# EAGLE design output (EAGLE 7.2.0)
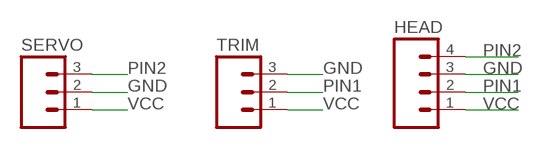
[diagram p0: schematic, sheet 1]

## Parts
HEAD  M04LONGPADS  [1X04_LONGPADS]
SERVO  M03PTH  [1X03]
TRIM  M03PTH  [1X03]

## Nets
GND: HEAD.3 SERVO.2 TRIM.3
PIN1: HEAD.2 TRIM.2
PIN2: HEAD.4 SERVO.3
VCC: HEAD.1 SERVO.1 TRIM.1

## Library data of the parts
HEAD = 01_SparkFun:M04: Header 4 Standard 4-pin 0.1" header. Use with straight break away headers (SKU : PRT-00116), right angle break away headers (PRT-00553), swiss pins (PRT-00743), machine pins (PRT-00117), and female headers (PRT-00115). Molex polarized connector foot print use with SKU : PRT-08231 with associated crimp pins and housings.
SERVO TRIM = 01_SparkFun:M03: Header 3 Standard 3-pin 0.1" header. Use with straight break away headers (SKU : PRT-00116), right angle break away headers (PRT-00553), swiss pins (PRT-00743), machine pins (PRT-00117), and female headers (PRT-00115). Molex polarized connector foot print use with SKU : PRT-08232 with associated crimp pins and housings.

## Board
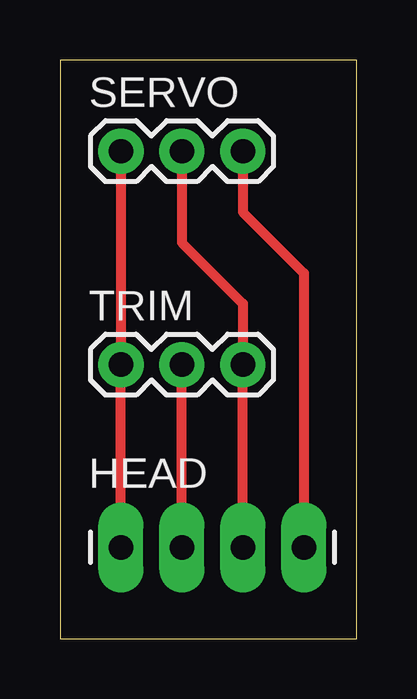
[diagram p1: board, top side]

Size 12.37 x 24.12 mm. Coordinates in mm from the lower left corner, seen from the top.
Outline: 0,0 12.37,0 12.37,24.12 0,24.12 0,0
Copper layers (1*16): Top 0.035mm / dielectric 1.5mm / Bottom 0.035mm
Design rules "default": minimum track width 10mil, minimum drill 24mil, track to track 8mil, track to pad 8mil, pad to pad 8mil, via to via 8mil, smd to smd 8mil, copper to edge 40mil, drill to drill 8mil, minimum pad ring 10mil, minimum via ring 8mil, stop-mask expansion 4mil, vias tented up to drill 0mil, thermal gap 10mil

### Footprints (pad centres in the part's own frame; a part is rotated, then mirrored left to right if it is on the bottom)
1X04_LONGPADS = drill 1.016 pad 1.88 long: 1 0,0; 2 2.54,0; 3 5.08,0; 4 7.62,0
1X03 = drill 1.016 pad 1.88: 1 0,0; 2 2.54,0; 3 5.08,0

### Placement (x,y rotation side)
HEAD  2.54,3.81 0 top
SERVO  2.54,20.32 0 top
TRIM  2.54,11.43 0 top

### Tracks (layer width: path | path; a pad name or v marks a point on that pad's centre or on a via)
GND
  Top 0.406: SERVO.2 5.08,16.51 7.62,13.97 TRIM.3 HEAD.3
PIN1
  Top 0.406: HEAD.2 TRIM.2
PIN2
  Top 0.406: SERVO.3 7.62,17.78 10.16,15.24 HEAD.4
VCC
  Top 0.406: HEAD.1 TRIM.1 SERVO.1